# Altium project FM Transmitter.PrjPcb
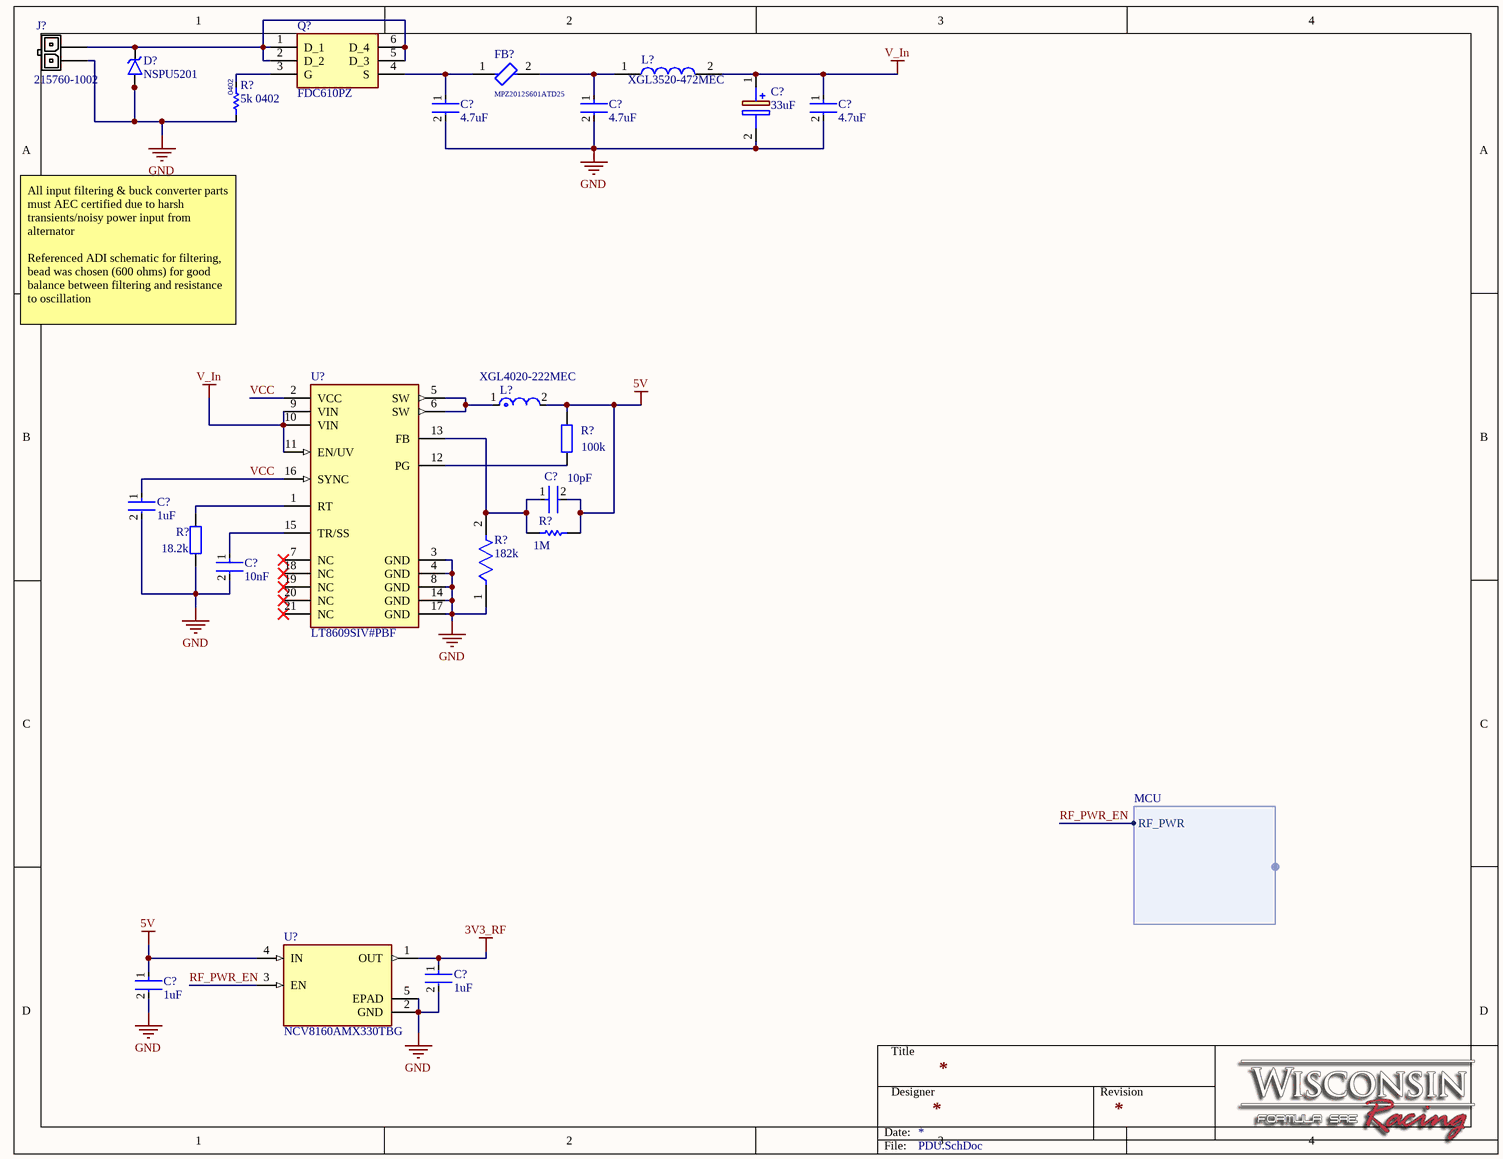
[diagram p0: PDU.SchDoc]
2 sheets, 22 parts. Net scope: global (net labels, ports and power ports of the same name join across sheets).
Sheets:
  Schem.SchDoc
  PDU.SchDoc

## Sheet Schem.SchDoc
size 279 x 215 mm; SheetNumber: 1; SheetTotal: 1

### Notes on the sheet
- Title
- Designer
- Revision
- Date:
- File:

## Sheet PDU.SchDoc
size 279 x 215 mm; SheetNumber: 2; SheetTotal: 2

### Parts
(Parts that share a designator on the sheet are numbered #1, #2 ... from top to bottom, then left to right.)
C?#1  33uF  [MAL215097904E3]
C?#2  4.7uF  [FP-CGA4J-IPC_C]
C?#3  4.7uF  [FP-CGA4J-IPC_C]
C?#4  4.7uF  [FP-CGA4J-IPC_C]
C?#5  1uF  [FP-GRT155-0_1-IPC_A]
C?#6  10pF  [FP-GCM155-0_05-IPC_C]
C?#7  10nF  [FP-GCM155-0_05-IPC_C]
C?#8  1uF  [FP-GRM155-0_1-IPC_C]
C?#9  1uF  [FP-GRM155-0_1-IPC_C]
D?  NSPU5201  [NSPM5131MUTBG]
FB?  MPZ2012S601ATD25  [BEADC2012X105N]
J?  215760-1002  [215760-1002-Footprint-1]
L?#1  XGL3520-472MEC  [XGL3520472MEC]
L?#2  XGL4020-222MEC  [FP-XGL4020-MFG]
Q?  FDC610PZ  [SOT95P280X110-6N]
R?#1  5k 0402  [Res0402-Type-1]
R?#2  100k  [WRIS-RSKS_0402]
R?#3  1M  [RESC1005X40X25NL05T10]
R?#4  18.2k  [WRIS-RSKS_0402]
R?#5  182k  [FP-AC0402-IPC_C]
U?#1  LT8609SIV#PBF  [FP-LQFN-16-05-08-1516-MFG]
U?#2  NCV8160AMX330TBG  [VREG_NCV8160AMX330TBG]

### Harnesses
MCU: RF_PWR

### Nets
3V3_RF: C?#8.1 U?#2.1(OUT)
5V: C?#6.2 C?#9.1 L?#2.2 R?#2.2 R?#3.2 U?#2.4(IN)
GND: C?#1.2(-) C?#2.2 C?#3.2 C?#4.2 C?#5.2 C?#7.2 C?#8.2 C?#9.2 D?.5(GND_(A)_1) D?.6(GND_(A)_2) D?.7(GND_(A)_3) D?.8(GND_(A)_4) J?.2 R?#1.1 R?#4.1 R?#5.1 U?#1.3(GND) U?#1.4(GND) U?#1.8(GND) U?#1.14(GND) U?#1.17(GND) U?#2.2(GND) U?#2.5(EPAD)
V_In: C?#1.1(+) C?#4.1 L?#1.2 U?#1.9(VIN) U?#1.10(VIN) U?#1.11(EN/UV)
RF_PWR_EN: U?#2.3(EN) ; harness MCU.RF_PWR
VCC: C?#5.1 U?#1.2(VCC) U?#1.16(SYNC)
NetC?#2_1: C?#2.1 FB?.1 Q?.4(S)
NetC?#3_1: C?#3.1 FB?.2 L?#1.1
NetC?#6_1: C?#6.1 R?#3.1 R?#5.2 U?#1.13(FB)
NetC?#7_1: C?#7.1 U?#1.15(TR/SS)
NetD?_1: D?.1 D?.2 J?.1 Q?.1(D_1) Q?.2(D_2) Q?.5(D_3) Q?.6(D_4)
NetL?#2_1: L?#2.1 U?#1.5(SW) U?#1.6(SW)
NetQ?_3: Q?.3(G) R?#1.2
NetR?#2_1: R?#2.1 U?#1.12(PG)
NetR?#4_2: R?#4.2 U?#1.1(RT)

Not connected (* = marked no-connect by the designer): U?#1 7(NC)* 18(NC)* 19(NC)* 20(NC)* 21(NC)*

### Notes on the sheet
- All input filtering & buck converter parts must AEC certified due to harsh transients/noisy power input from alternator
  Referenced ADI schematic for filtering, bead was chosen (600 ohms) for good balance between filtering and resistance to oscillation
- Title
- Designer
- Revision
- Date:
- File:
- (in symbol CMP-Res-00031-1) 0402

### Library data of the parts
C?#1 = MAL215097904E3: Capacitor Polarised / MAL215097904E3; Manufacturer_Name: Vishay; Datasheet Link: https://www.vishay.com/docs/28395/150crz.pdf; Height: 10.5mm; Manufacturer_Part_Number: MAL215097904E3; Mouser Part Number: 594-MAL215097904E3; Mouser Price/Stock: https://www.mouser.co.uk/ProductDetail/Vishay-BC-Components/MAL215097904E3?qs=LPi%252B6n6Uj5NKbv7W8MBx6Q%3D%3D; Arrow Part Number: MAL215097904E3; Arrow Price/Stock: https://www.arrow.com/en/products/mal215097904e3/vishay?region=nac
C?#2-C?#4 = CMP-08246-000171-1: Cap Ceramic 4.7uF 50V X7R 10% Pad SMD 0805 +125°C Automotive T/R
C?#5 = CMP-06035-047663-1: Multi-Layer Ceramic Capacitor 1uF 25V X6S ±10% 0402 Paper T/R / GRT155C81E105KE13D
C?#6 = CMP-06035-039712-1: Ceramic Capacitor for Automotive 10pF ±5% 50VDC C0G 0402 Paper T/R; Voltage Rating: 50V; Case/Package: 0402; Dielectric: C0G; Package Quantity: 10000; Ratings: AEC-Q200; Max Operating Temperature: 125°C; Width: 0.02inch; REACH SVHC: No SVHC; Mount: Surface Mount; Min Operating Temperature: -55°C; Lead Free: Lead Free; Packaging: Tape and Reel; Capacitance: 10pF; Case Code (Imperial): 0402; Tolerance: 5%; Height: 0.5mm; Thickness: 0.022inch; Length: 0.039inch; Case Code (Metric): 1005; Weight: 0.000212oz; Voltage Rating (DC): 50V; Termination: SMD/SMT
C?#7 = CMP-2008-03723-3: Ceramic Capacitor for Automotive 10nF ±10% 50VDC X7R 0402 Paper T/R / GCM155R71H103KA55D; Voltage Rating (DC): 50V; Min Operating Temperature: -55°C; Radiation Hardening: No; Mount: Surface Mount; Thickness: 0.022inch; Package Quantity: 1; Case Code (Imperial): 0402; Lead Free: Lead Free; Case/Package: 0402; Depth: 0.5mm; Termination: SMD/SMT; Tolerance: 10%; Voltage: 50V; Packaging: Tape and Reel; Width: 0.02inch; REACH SVHC: No SVHC; Height: 0.5mm; Max Operating Temperature: 125°C; Case Code (Metric): 1005; Voltage Rating: 50V; Capacitance: 10nF; Ratings: AEC-Q200; Length: 1mm; Dielectric: X7R
C?#8 C?#9 = CMP-06035-028020-1: Chip Multilayer Ceramic Capacitors for General Purpose, 0402, 1.0uF, X7R, 15%, 10%, 10V / GRM155Z71A105KE01D
D? = CMP-004-000061-2: Unidirectional High Voltage ESD and Surge Protection; Provides ESD Protection to IEC6100042 Level 4: +/-30 kV Contact Discharge; Small Package: 1.8 mm x 2.0 mm; These Devices are PbFree; Manufacturer_Name: onsemi; Arrow Part Number: NSPU5201MUTBG; Design Item ID: NSPU5201MUTBG; Source: SamacSys.SchLib; Mouser Price/Stock: https://www.mouser.co.uk/ProductDetail/ON-Semiconductor/NSPU5201MUTBG?qs=byeeYqUIh0OtIrNH4%2Fsnzg%3D%3D; Mouser Part Number: 863-NSPU5201MUTBG; Height: 0mm; Datasheet Link: https://www.onsemi.com/pub/Collateral/NSPU5201-D.PDF; Manufacturer_Part_Number: NSPU5201MUTBG; Arrow Price/Stock: https://www.arrow.com/en/products/nspu5201mutbg/on-semiconductor
FB? = CMP-002-000016-2: Ferrite Beads Multi-Layer Power 600Ohm 25% 100MHz 2A 100mOhm DCR 0805 Automotive T/R; Manufacturer_Name: TDK; Arrow Part Number: MPZ2012S601ATD25; Datasheet Link: https://product.tdk.com/system/files/dam/doc/product/emc/emc/beads/catalog/beads_automotive_power_mpz2012_en.pdf; Manufacturer_Part_Number: MPZ2012S601ATD25; Design Item ID: MPZ2012S601ATD25; Height: 1.05mm; Mouser Price/Stock: https://www.mouser.co.uk/ProductDetail/TDK/MPZ2012S601ATD25?qs=n0%2F4YYxsltT7vo9AjVUU7w%3D%3D; Mouser Part Number: 810-MPZ2012S601ATD25; Source: SamacSys.SchLib; Arrow Price/Stock: https://www.arrow.com/en/products/mpz2012s601atd25/tdk.html?utm_currency=USD&region=europe
J? = CMP-007-000050-6: Micro-Fit+ Right-Angle Header, 3.00mm Pitch, Single Row, 2 Circuits, Matte Tin (Sn) Plating, UL 94V-0, Glow-Wire Capable, Black; Manufacturer 1: Molex; Number of Contacts: 2; Manufacturer Part Number 1: 215760-1002; Number of Rows: 1
L?#1 = XGL3520-472MEC: Inductor; Manufacturer_Name: COILCRAFT; Datasheet Link: https://www.coilcraft.com/getmedia/d18b8771-c466-42ab-98b9-5b7a3721ea57/xgl3520.pdf?srsltid=AfmBOoq9-uDh3EmdFKVY7cd9_AL22AmMmwAAQ9UBadXdflM2b3sgRKIR; Height: 2mm; Manufacturer_Part_Number: XGL3520-472MEC
L?#2 = CMP-11268-000045-2: Shielded Power Inductors
Q? = FDC610PZ: MOSFET (P-Channel); Manufacturer_Name: onsemi; Datasheet Link: https://www.onsemi.com/pub/Collateral/FDC610PZ-D.PDF; Height: 1.1mm; Manufacturer_Part_Number: FDC610PZ; Mouser Part Number: 512-FDC610PZ; Mouser Price/Stock: https://www.mouser.co.uk/ProductDetail/onsemi-Fairchild/FDC610PZ?qs=6olcXJbp99R1vIAdhgXLVw%3D%3D; Arrow Part Number: FDC610PZ; Arrow Price/Stock: https://www.arrow.com/en/products/fdc610pz/on-semiconductor
R?#1 = CMP-Res-00031-1: Fixed Resistor, Metal Glaze/thick Film, 0.0625W, 5000ohm, 50V, 1% +/-Tol, 100ppm/Cel, Surface Mount, 0402; Power: 63mW; Resistance: 5k; Tolerance: 1%
R?#2 = CMP-03913-145532703-2: Resistor, 100K, 0.1W, Thick Film, 0402 Rohs Compliant: Yes; Manufacturer Lifecycle Status: ACTIVE; Resistance: 100kΩ; YEOL: 1 = Estimated lifetime > 10 years; Width: 500µm; Min Operating Temperature: -55°C; Height: 350µm; Length: 1mm; Lifecycle Status: Production; Max Operating Temperature: 155°C; RoHS: Compliant
R?#3 = CMP-2002-07490-1: Manufacturer: Yageo / Phycomp; Part Number: RC0402FR-071ML
R?#4 = CMP-03913-145532814-2: Resistor, 18K2, 0.1W, Thick Film, 0402 Rohs Compliant: Yes; Manufacturer Lifecycle Status: ACTIVE; YEOL: 1 = Estimated lifetime > 10 years; Resistance: 18.2kΩ; Min Operating Temperature: -55°C; Height: 350µm; RoHS: Compliant; Lifecycle Status: Production; Width: 500µm; Length: 1mm; Max Operating Temperature: 155°C
R?#5 = CMP-03412-035751-2: RES 182kΩ ±1% 0.063W 0402; Max Power Dissipation: 63mW; Resistance: 182kR; Power Rating: 62.5mW; Temperature Coefficient: 100ppm/°C; Voltage Rating: 50V; Number of Terminations: 2; Tolerance: 1%; Case/Package: 0402; Min Operating Temperature: -55°C; Length: 0.039inch; Packaging: Tape and Reel; Case Code (Metric): 1005; Termination: SMD/SMT; Width: 0.5mm; RoHS Compliant: Yes; Resistor Type: Thick Film; Height: 0.015inch; Max Operating Temperature: 155°C; Series: AC; Case Code (Imperial): 0402; Weight: 2.3E-05oz; Features: Moisture Resistant
U?#1 = CMP-09139-000009-1: IC REG BUCK ADJUSTABLE 2A 16LQFN; Manufacturer: Analog Devices; Standoff Height: 0.01mm; Nominal Supply Current: 1-1.7uA; Min Supply Voltage: 3V; Max Duty Cycle: 100%; Output Type: AdjustableProgrammable; Max Junction Temp: +125°C; Switching Frequency: 200-2200kHz; Max Supply Voltage: 42V; Number Of Outputs: 1; Digikey Description: IC REG BUCK ADJUSTABLE 2A 16LQFN; Octopart: https://octopart.com/lt8609siv%23pbf-analog+devices-88316701; Automotive: No; Package: LQFN-16-05-08-1516; Temperature Range High: +125°C; Category: IC; Temperature Range Low: -40°C; ComponentLink2Description: Datasheet; Output Current: 2A; Mouser Description: LT8609S - 42V, 2A/3A Peak Synchronous Step-Down Regulator with 2.5µA Quiescent Current; Temperature: -40°C to +125°C; ComponentLink2URL: https://www.analog.com/media/en/technical-documentation/data-sheets/LT8609S.pdf; RoHS: TRUE; Device Class L2: Power Management ICs; Device Class L3: Voltage Regulators - Switching; Height: 1.03mm; Device Class L1: Integrated Circuits (ICs); Switching Topology: Buck; Lead Free: Yes; Manufacturer Part Number: LT8609SIV#PBF
U?#2 = CMP-006-000097-1: Linear Voltage Regulator IC Positive Fixed 1 Output 250mA 4-XDFN (1x1); MF: ON Semiconductor; Design Item ID: NCV8160AMX330TBG; SnapEDA_Link: https://www.snapeda.com/parts/NCV8160AMX330TBG/Onsemi/view-part/?ref=snap; Pin Count: 5; Check_prices: https://www.snapeda.com/parts/NCV8160AMX330TBG/Onsemi/view-part/?ref=eda; Value: *; MP: NCV8160AMX330TBG; Source: NCV8160AMX330TBG.SchLib; Component Type: Standard; Package: XDFN-4 ON Semiconductor